# Altium project Fault detector.PrjPcb
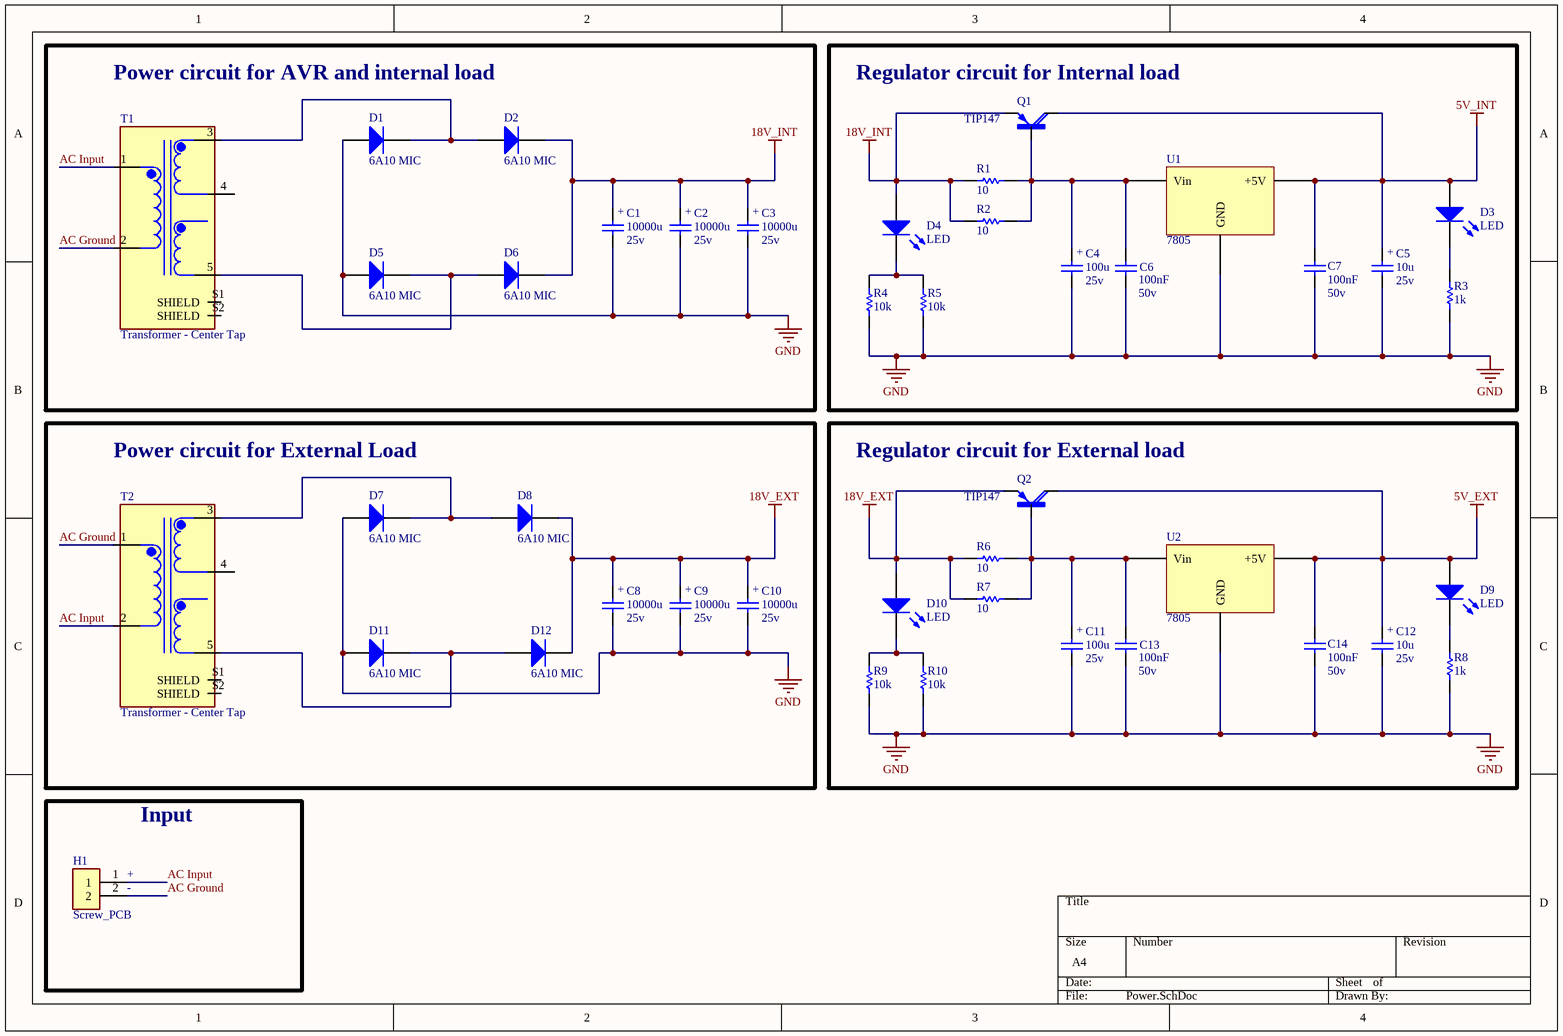
[diagram p0: Power.SchDoc]
3 sheets, 94 parts. Net scope: global (net labels, ports and power ports of the same name join across sheets).
Board files: PCB1.PcbDoc, Fault_Detect.PcbDoc
Sheets:
  Power.SchDoc
  AVR.SchDoc
  Loads.SchDoc

## Sheet Power.SchDoc
size A4; SheetNumber: 1; SheetTotal: 3

### Parts
C1  Volte: 25v  [MY_E7.5-16mm]  (hidden comment: 10000u)
C2  Volte: 25v  [MY_E7.5-16mm]  (hidden comment: 10000u)
C3  Volte: 25v  [MY_E7.5-16mm]  (hidden comment: 10000u)
C4  Volte: 25v  [MY_E2.5-5mm]  (hidden comment: 100u)
C5  Volte: 25v  [MY_E2.5-5mm]  (hidden comment: 10u)
C6  Volte: 50v  [C0805]  (hidden comment: 100nF)
C7  Volte: 50v  [C0805]  (hidden comment: 100nF)
C8  Volte: 25v  [MY_E7.5-16mm]  (hidden comment: 10000u)
C9  Volte: 25v  [MY_E7.5-16mm]  (hidden comment: 10000u)
C10  Volte: 25v  [MY_E7.5-16mm]  (hidden comment: 10000u)
C11  Volte: 25v  [MY_E2.5-5mm]  (hidden comment: 100u)
C12  Volte: 25v  [MY_E2.5-5mm]  (hidden comment: 10u)
C13  Volte: 50v  [C0805]  (hidden comment: 100nF)
C14  Volte: 50v  [C0805]  (hidden comment: 100nF)
D1  6A10 MIC  [R6_Axial]
D2  6A10 MIC  [R6_Axial]
D3  LED  [My_LED3MM]
D4  LED  [My_LED3MM]
D5  6A10 MIC  [R6_Axial]
D6  6A10 MIC  [R6_Axial]
D7  6A10 MIC  [R6_Axial]
D8  6A10 MIC  [R6_Axial]
D9  LED  [My_LED3MM]
D10  LED  [My_LED3MM]
D11  6A10 MIC  [R6_Axial]
D12  6A10 MIC  [R6_Axial]
H1  Screw_PCB  [Barrier_TB_8.26mm]
Q1  TIP147  [SOT93]
Q2  TIP147  [SOT93]
R1  10  [MY_(2w)_0617_22]
R2  10  [MY_(2w)_0617_22]
R3  1k  [R0603]
R4  10k  [R0603]
R5  10k  [R0603]
R6  10  [MY_(2w)_0617_22]
R7  10  [MY_(2w)_0617_22]
R8  1k  [R0603]
R9  10k  [R0603]
R10  10k  [R0603]
T1  Transformer - Center Tap  [Transformer_CT]
T2  Transformer - Center Tap  [Transformer_CT]
U1  7805  [MY_TO220_Heatsink 2 TO-220 (20x14x9mm)]
U2  7805  [MY_TO220_Heatsink 2 TO-220 (20x14x9mm)]

### Blocks framed on the sheet
Power circuit for AVR and internal load: C1-C3 D1 D2 D5 D6 T1
Regulator circuit for Internal load: C4-C7 D3 D4 Q1 R1-R5 U1
Power circuit for External Load: C8-C10 D7 D8 D11 D12 T2
Regulator circuit for External load: C11-C14 D9 D10 Q2 R6-R10 U2
Input: H1

### Nets
5V_EXT: C12.+ C14.2 D9.A Q2.C U2.3(+5V)
5V_INT: C5.+ C7.2 D3.A Q1.C U1.3(+5V)  [project net AVCC]
18V_EXT: C8.+ C9.+ C10.+ D8.K D10.A D12.K Q2.E R6.1 R7.1
18V_INT: C1.+ C2.+ C3.+ D2.K D4.A D6.K Q1.E R1.1 R2.1
GND: C1.- C2.- C3.- C4.- C5.- C6.1 C7.1 C8.- C9.- C10.- C11.- C12.- C13.1 C14.1 D1.A D5.A D7.A D11.A R3.2 R4.2 R5.2 R8.2 R9.2 R10.2 U1.2(GND) U2.2(GND)
AC Ground: H1.2 T1.2 T2.1
AC Input: H1.1 T1.1 T2.2
NetC4_+: C4.+ C6.2 Q1.B R1.2 R2.2 U1.1(Vin)
NetC11_+: C11.+ C13.2 Q2.B R6.2 R7.2 U2.1(Vin)
NetD1_K: D1.K D2.A T1.3
NetD3_K: D3.K R3.1
NetD4_K: D4.K R4.1 R5.1
NetD5_K: D5.K D6.A T1.5
NetD7_K: D7.K D8.A T2.3
NetD9_K: D9.K R8.1
NetD10_K: D10.K R9.1 R10.1
NetD11_K: D11.K D12.A T2.5

Not connected (* = marked no-connect by the designer): T1 4 S1(SHIELD) S2(SHIELD); T2 4 S1(SHIELD) S2(SHIELD)

### Notes on the sheet
- (in symbol Screw_PCB) +; -

### Library data of the parts
C1-C5 C8-C12 = Cap Pol: Polar capacitor; ASiD Part Number: C-AS
  C1-C3 C8-C10: Value: 10000u
  C4 C11: Value: 100u
  C5 C12: Value: 10u
C6 C7 C13 C14 = Cap ceramic: None polar capacitor; ASiD Part Number: C-AS; Value: 100nF
D1 D2 D5-D8 D11 D12 = 1N4007: 1 Amp Diode; ASiD Part Number: 1n4007-AS
D3 D4 D9 D10 = LED: Typical INFRARED GaAs LED; ASiD Part Number: LED-AS
H1 = Screw_PCB: PCB to screw header; MF: TE Connectivity; MP: 282837-2; SnapEDA_Link: https://www.snapeda.com/parts/282837-2/TE+Connectivity+AMP+Connectors/view-part/?ref=snap; Price: None; Check_prices: https://www.snapeda.com/parts/282837-2/TE+Connectivity+AMP+Connectors/view-part/?ref=eda; Purchase-URL: https://pricing.snapeda.com/search/part/282837-2/?ref=eda; Value: *; Availability: In Stock; Package: None
Q1 Q2 = TIP147: Bipolar (BJT) Transistor PNP 100 V 10 A - 125 W Through Hole TO-218; MF: NTE Electronics, Inc; SnapEDA_Link: https://www.snapeda.com/parts/TIP147/NTE+Electronics/view-part/?ref=snap; Package: None; Value: *; MP: TIP147; Check_prices: https://www.snapeda.com/parts/TIP147/NTE+Electronics/view-part/?ref=eda
R1-R10 = Res: Standard resistor; ASiD Part Number: Res-AS
  R1 R2 R6 R7: Value: 10
  R3 R8: Value: 1k
  R4 R5 R9 R10: Value: 10k
T1 T2 = Transformer - Center Tap: Voltage - Primary 220V,Voltage - Secondary Parallel; MP: F-151XP; Package: None; Price: None; Value: *; Availability: Unavailable
U1 U2 = 7805: Regulator; ASiD Part Number: 7805-AS

## Sheet AVR.SchDoc
size A; SheetNumber: 2; SheetTotal: 3
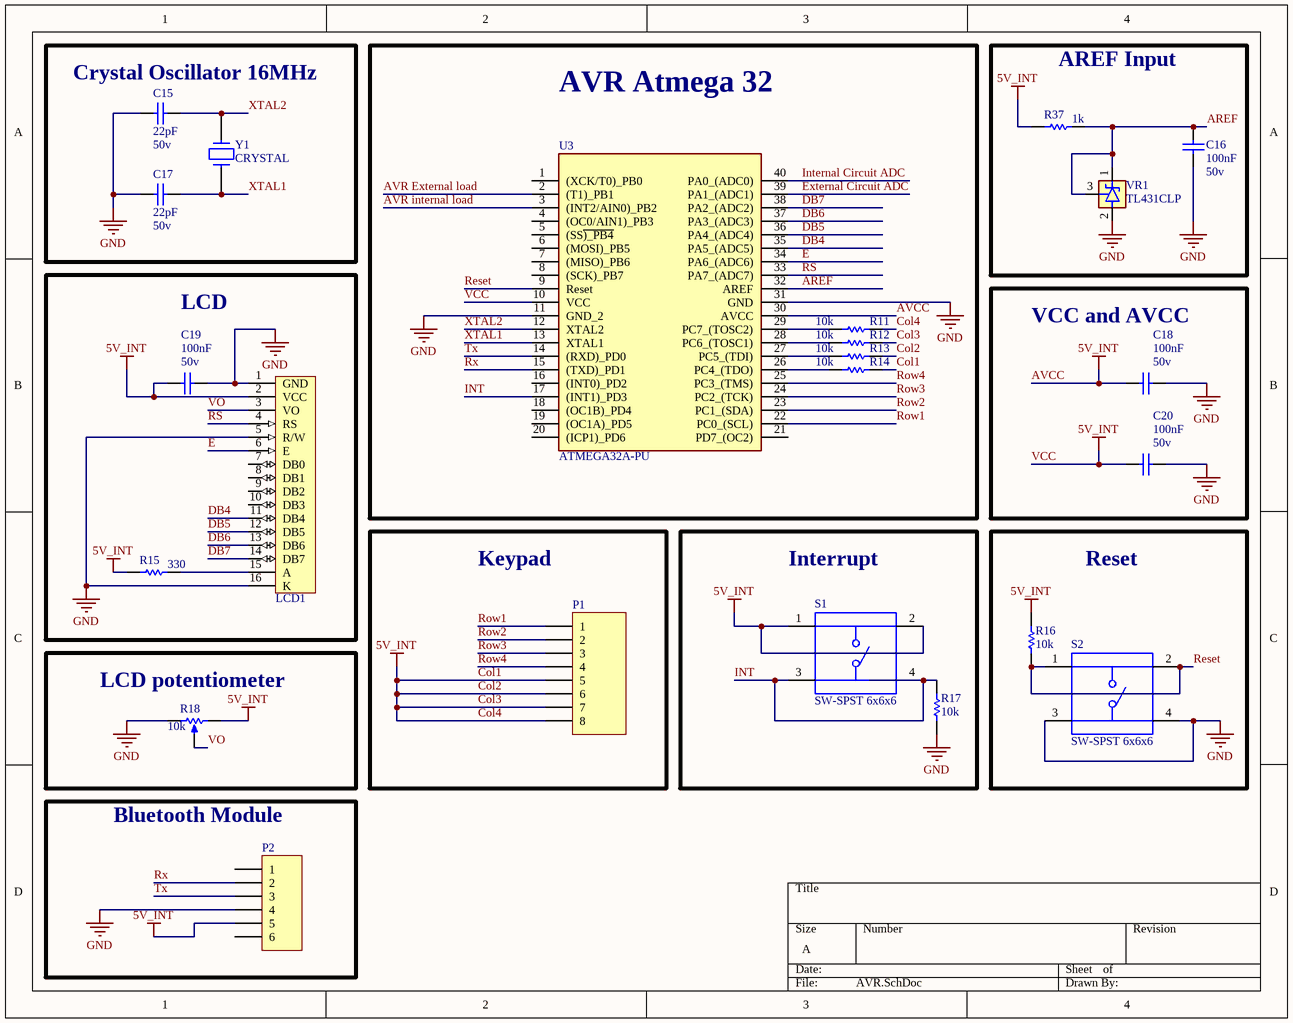
[diagram p1: AVR.SchDoc]

### Parts
C15  Volte: 50v  [C0805]  (hidden comment: 22pF)
C16  Volte: 50v  [C0805]  (hidden comment: 100nF)
C17  Volte: 50v  [C0805]  (hidden comment: 22pF)
C18  Volte: 50v  [C0805]  (hidden comment: 100nF)
C19  Volte: 50v  [C0805]  (hidden comment: 100nF)
C20  Volte: 50v  [C0805]  (hidden comment: 100nF)
LCD1  LCD 16X2  [My_LCD 16x2-A]  (value not drawn)
P1  Header 8  [MY_1X08]  (value not drawn)
P2  Header 6  [MY_FE06]  (value not drawn)
R11  10k  [R0603]
R12  10k  [R0603]
R13  10k  [R0603]
R14  10k  [R0603]
R15  330  [MY_(0.25w)_0207_10]
R16  10k  [R0603]
R17  10k  [R0603]
R18  10k  [MY_TRIM3296W]
R37  1k  [R0603]
S1  SW-SPST 6x6x6  [SW-SPST 6x6x6]
S2  SW-SPST 6x6x6  [SW-SPST 6x6x6]
U3  ATMEGA32A-PU  [DIP40]
VR1  TL431CLP  [TO-92]
Y1  CRYSTAL  [My_Crystal]

### Blocks framed on the sheet
Crystal Oscillator 16MHz: C15 C17 Y1
AVR Atmega 32: R11-R14 U3
AREF Input: C16 R37 VR1
LCD: C19 LCD1 R15
VCC and AVCC: C18 C20
Keypad: P1
Interrupt: R17 S1
Reset: R16 S2
LCD potentiometer: R18
Bluetooth Module: P2

### Nets
AVCC: C18.2 C19.2 C20.2 LCD1.2(VCC) P1.5 P1.6 P1.7 P1.8 P2.5 R11.2 R12.2 R13.2 R14.2 R15.1 R16.1 R18.2(BOT) R37.1 S1.1 S1.2 U3.10(VCC) U3.30(AVCC)  [also labelled 5V_INT, Col1, Col2, Col3, Col4, VCC]
GND: C15.1 C16.2 C17.1 C18.1 C19.1 C20.1 LCD1.1(GND) LCD1.5(R/W) LCD1.16(K) P2.4 R17.2 R18.1(TOP) S2.3 S2.4 U3.11(GND_2) U3.31(GND) VR1.2(ANODE)
AREF: C16.1 R37.2 U3.32(AREF) VR1.1(CATHODE) VR1.3(REF)
AVR External load: U3.2((T1)_PB1)
AVR internal load: U3.3((INT2/AIN0)_PB2)
DB4: LCD1.11(DB4) U3.35(PA5_(ADC5))
DB5: LCD1.12(DB5) U3.36(PA4_(ADC4))
DB6: LCD1.13(DB6) U3.37(PA3_(ADC3))
DB7: LCD1.14(DB7) U3.38(PA2_(ADC2))
E: LCD1.6(E) U3.34(PA6_(ADC6))
External Circuit ADC: U3.39(PA1_(ADC1))
INT: R17.1 S1.3 S1.4 U3.17((INT1)_PD3)
Internal Circuit ADC: U3.40(PA0_(ADC0))
Reset: R16.2 S2.1 S2.2 U3.9(Reset)
Row1: P1.1 U3.22(PC0_(SCL))
Row2: P1.2 U3.23(PC1_(SDA))
Row3: P1.3 U3.24(PC2_(TCK))
Row4: P1.4 U3.25(PC3_(TMS))
RS: LCD1.4(RS) U3.33(PA7_(ADC7))
Rx: P2.2 U3.15((TXD)_PD1)
Tx: P2.3 U3.14((RXD)_PD0)
VO: LCD1.3(VO) R18.3(TAP)
XTAL1: C17.2 U3.13(XTAL1) Y1.1
XTAL2: C15.2 U3.12(XTAL2) Y1.2
NetLCD1_15: LCD1.15(A) R15.2
NetR11_1: R11.1 U3.29(PC7_(TOSC2))
NetR12_1: R12.1 U3.28(PC6_(TOSC1))
NetR13_1: R13.1 U3.27(PC5_(TDI))
NetR14_1: R14.1 U3.26(PC4_(TDO))

Not connected (* = marked no-connect by the designer): LCD1 7(DB0) 8(DB1) 9(DB2) 10(DB3); P2 1 6; U3 1((XCK/T0)_PB0) 4((OC0/AIN1)_PB3) 5((SS~{)_PB4}) 6((MOSI)_PB5) 7((MISO)_PB6) 8((SCK)_PB7) 16((INT0)_PD2) 18((OC1B)_PD4) 19((OC1A)_PD5) 20((ICP1)_PD6) 21(PD7_(OC2))

### Library data of the parts
C15-C20 = Cap ceramic: as C6 on sheet Power
  C15 C17: Value: 22pF
  C16 C18-C20: Value: 100nF
LCD1 = LCD 16X2: LCD 16X2 Character lcd; ASiD Part Number: LCD 16X2-AS
P1 = Header 8: Header, 8-Pin, Dual row; ASiD Part Number: Header 8-AS
P2 = Header 6: Header, 6-Pin; ASiD Part Number: Header 6-AS
R11-R17 R37 = Res: as R1 on sheet Power
  R11-R14 R16 R17: Value: 10k
  R15: Value: 330
  R37: Value: 1k
R18 = Variable Resistor: Potentiometer; ASiD Part Number: Variable Resistor-AS; Value: 10k
S1 S2 = SW-SPST 6x6x6: 6 x 6 mm, 6 mm Actuator Height, 160 gf, Black, Long Crimped, Through Hole, SPST, Tactile Switch; MF: CUI Devices; MP: TS02-66-60-BK-160-LCR-D; CUI_purchase_URL: https://www.cuidevices.com/product/switches/tactile-switches/ts02-series?utm_source=snapeda.com&utm_medium=referral&utm_campaign=snapedaBOM; Check_prices: https://www.snapeda.com/parts/TS02-66-60-BK-160-LCR-D/CUI+Devices/view-part/?ref=eda; Purchase-URL: https://pricing.snapeda.com/search/part/TS02-66-60-BK-160-LCR-D/?ref=eda; Price: None; Availability: In Stock; SnapEDA_Link: https://www.snapeda.com/parts/TS02-66-60-BK-160-LCR-D/CUI+Devices/view-part/?ref=snap; Package: None; Value: *
U3 = ATMEGA32A-PU: AVR AVR ATmega Microcontroller IC 8-Bit 16MHz 32KB (16K x 16) FLASH 40-PDIP; MF: Microchip; SnapEDA_Link: https://www.snapeda.com/parts/ATMEGA32A-PU/Microchip/view-part/?ref=snap; Package: PDIP-40 Microchip; Value: *; MP: ATMEGA32A-PU; Check_prices: https://www.snapeda.com/parts/ATMEGA32A-PU/Microchip/view-part/?ref=eda
VR1 = TL431CLP: Adjustable precision shunt regulator; MF: Texas Instruments; SnapEDA_Link: https://www.snapeda.com/parts/TL431CLP/Texas+Instruments/view-part/?ref=snap; Package: TO-92 Texas Instruments; Value: *; MP: TL431CLP; Check_prices: https://www.snapeda.com/parts/TL431CLP/Texas+Instruments/view-part/?ref=eda
Y1 = CRYSTAL: ASiD Part Number: Crystal-AS

## Sheet Loads.SchDoc
size A; SheetNumber: 3; SheetTotal: 3
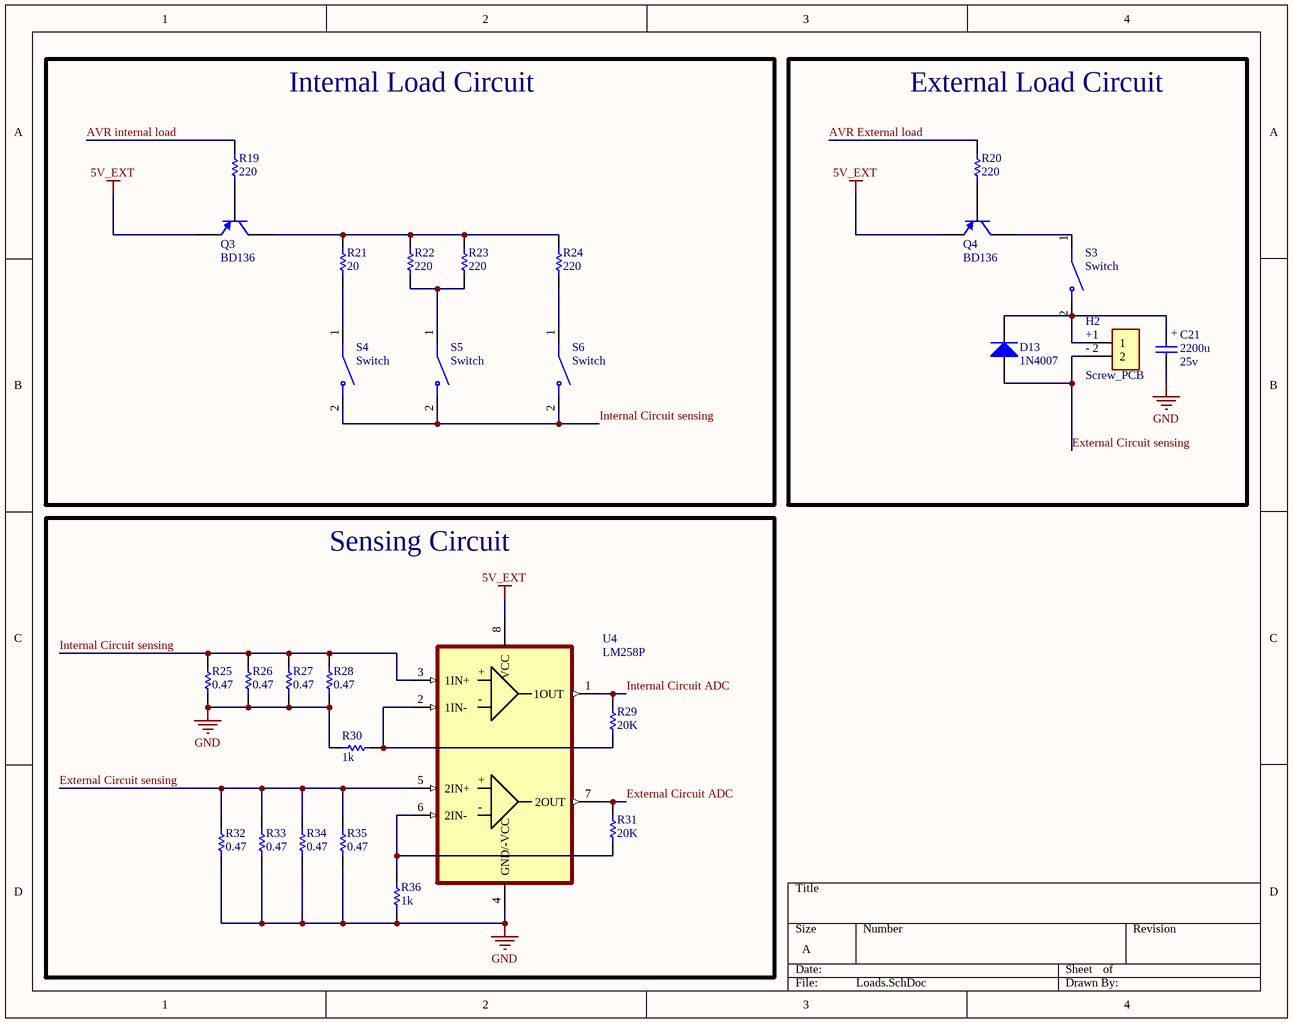
[diagram p2: Loads.SchDoc]

### Parts
C21  Volte: 25v  [MY_E5-13mm]  (hidden comment: 2200u)
D13  1N4007  [My_DO41]
H2  Screw_PCB  [Screw_PCB]
Q3  BD136  [My_TO126]
Q4  BD136  [My_TO126]
R19  220  [MY_(0.25w)_0207_10]
R20  220  [MY_(0.25w)_0207_10]
R21  20  [MY_(2w)_0617_22]
R22  220  [MY_(0.25w)_0207_10]
R23  220  [MY_(0.25w)_0207_10]
R24  220  [MY_(0.25w)_0207_10]
R25  0.47  [R0603]
R26  0.47  [R0603]
R27  0.47  [R0603]
R28  0.47  [R0603]
R29  20K  [R0603]
R30  1k  [R0603]
R31  20K  [R0603]
R32  0.47  [R0603]
R33  0.47  [R0603]
R34  0.47  [R0603]
R35  0.47  [R0603]
R36  1k  [R0603]
S3  Switch  [ON/OFF Switch]
S4  Switch  [ON/OFF Switch]
S5  Switch  [ON/OFF Switch]
S6  Switch  [ON/OFF Switch]
U4  LM258P  [DIP 8 LM258]

### Blocks framed on the sheet
Internal Load Circuit: Q3 R19 R21-R24 S4-S6
External Load Circuit: C21 D13 H2 Q4 R20 S3
Sensing Circuit: R25-R36 U4

### Nets
5V_EXT: Q3.E Q4.E U4.8(VCC)
GND: C21.- R25.2 R26.2 R27.2 R28.2 R30.1 R32.2 R33.2 R34.2 R35.2 R36.2 U4.4(GND/-VCC)
AVR External load: R20.1
AVR internal load: R19.1
External Circuit ADC: R31.1 U4.7(2OUT)
External Circuit sensing: D13.A H2.2 R32.1 R33.1 R34.1 R35.1 U4.5(2IN+)
Internal Circuit ADC: R29.1 U4.1(1OUT)
Internal Circuit sensing: R25.1 R26.1 R27.1 R28.1 S4.2(COM) S5.2(COM) S6.2(COM) U4.3(1IN+)
NetC21_+: C21.+ D13.K H2.1 S3.2(COM)
NetQ3_B: Q3.B R19.2
NetQ3_C: Q3.C R21.1 R22.1 R23.1 R24.1
NetQ4_B: Q4.B R20.2
NetQ4_C: Q4.C S3.1(NO)
NetR21_2: R21.2 S4.1(NO)
NetR22_2: R22.2 R23.2 S5.1(NO)
NetR24_2: R24.2 S6.1(NO)
NetR29_2: R29.2 R30.2 U4.2(1IN-)
NetR31_2: R31.2 R36.1 U4.6(2IN-)

### Notes on the sheet
- (in symbol LM258P) +; -
- (in symbol Screw_PCB) +; -

### Library data of the parts
C21 = Cap Pol: Polar capacitor; ASiD Part Number: C-AS; Value: 2200u
D13 = 1N4007: 1 Amp Diode; ASiD Part Number: 1n4007-AS
H2 = Screw_PCB: as H1 on sheet Power; SnapEDA_Link: https://www.snapeda.com/parts/282837-2/TE+Connectivity+AMP+Connectors/view-part/?ref=snap; Price: None; Check_prices: https://www.snapeda.com/parts/282837-2/TE+Connectivity+AMP+Connectors/view-part/?ref=eda; Purchase-URL: https://pricing.snapeda.com/search/part/282837-2/?ref=eda; Value: *; Availability: In Stock; Package: None
Q3 Q4 = BD136: Darlington transistor; ASiD Part Number: BD136-AS
R19-R36 = Res: as R1 on sheet Power
  R19 R20 R22-R24: Value: 220
  R21: Value: 20
  R25-R28 R32-R35: Value: 0.47
  R29 R31: Value: 20K
  R30 R36: Value: 1k
S3-S6 = Switch: Rocker Switch, RR5 Series, SPST,OFF-ON,Blk Rocker,I/O Legend, 20A, 125VAC, QC; MP: RR511D1121; MF: E-Switch; Check_prices: https://www.snapeda.com/parts/RR511D1121/E-Switch/view-part/?ref=eda; Value: *; Availability: In Stock; Price: None; Package: None; SnapEDA_Link: https://www.snapeda.com/parts/RR511D1121/E-Switch/view-part/?ref=snap; Purchase-URL: https://pricing.snapeda.com/search/part/RR511D1121/?ref=eda
U4 = LM258P: Dual standard, industrial-grade, operational amplifier 8-PDIP -25 to 85; MF: Texas Instruments; Price: None; Availability: Warning; SnapEDA_Link: https://www.snapeda.com/parts/LM258P/Texas%20Instruments/view-part/386286/?ref=snap; Package: PDIP-8 Texas; MP: LM258P; Value: *; Purchase-URL: https://pricing.snapeda.com/search/part/LM258P/?ref=eda

## Nets that join several sheets
5V_EXT: Power (5 pins), Loads (Q3.E Q4.E U4.8)
AVCC: Power (5 pins), AVR (21 pins)
GND: Power (26 pins), AVR (17 pins), Loads (12 pins)
AVR External load: AVR (U3.2), Loads (R20.1)
AVR internal load: AVR (U3.3), Loads (R19.1)
External Circuit ADC: AVR (U3.39), Loads (R31.1 U4.7)
Internal Circuit ADC: AVR (U3.40), Loads (R29.1 U4.1)